# EAGLE design lupa300-card (EAGLE 8.6.1)

## Sheet 1 of 4: LUPA300
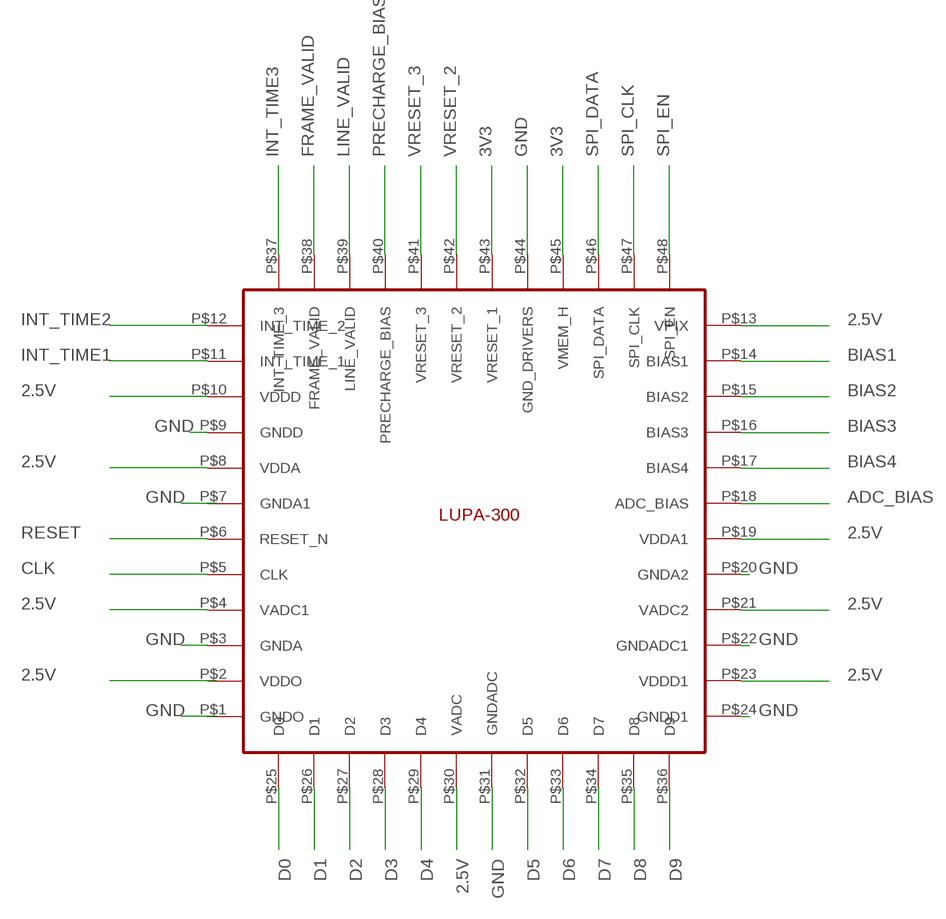
[diagram p0: schematic, sheet 1]

### Parts
U$1  LUPA300  [LUPA300]

### Nets
2.5V: U$1.P$2(VDDO) U$1.P$4(VADC1) U$1.P$8(VDDA) U$1.P$10(VDDD) U$1.P$13(VPIX) U$1.P$19(VDDA1) U$1.P$21(VADC2) U$1.P$23(VDDD1) U$1.P$30(VADC) ; also sheet 2,3
3V3: U$1.P$43(VRESET_1) U$1.P$45(VMEM_H) ; also sheet 3
ADC_BIAS: U$1.P$18(ADC_BIAS) ; also sheet 2
BIAS1: U$1.P$14(BIAS1) ; also sheet 2
BIAS2: U$1.P$15(BIAS2) ; also sheet 2
BIAS3: U$1.P$16(BIAS3) ; also sheet 2
BIAS4: U$1.P$17(BIAS4) ; also sheet 2
CLK: U$1.P$5(CLK) ; also sheet 4
D0: U$1.P$25(D0) ; also sheet 4
D1: U$1.P$26(D1) ; also sheet 4
D2: U$1.P$27(D2) ; also sheet 4
D3: U$1.P$28(D3) ; also sheet 4
D4: U$1.P$29(D4) ; also sheet 4
D5: U$1.P$32(D5) ; also sheet 4
D6: U$1.P$33(D6) ; also sheet 4
D7: U$1.P$34(D7) ; also sheet 4
D8: U$1.P$35(D8) ; also sheet 4
D9: U$1.P$36(D9) ; also sheet 4
FRAME_VALID: U$1.P$38(FRAME_VALID) ; also sheet 4
GND: U$1.P$1(GNDO) U$1.P$3(GNDA) U$1.P$9(GNDD) U$1.P$20(GNDA2) U$1.P$22(GNDADC1) U$1.P$24(GNDD1) U$1.P$31(GNDADC) U$1.P$44(GND_DRIVERS) ; also sheet 2,3,4
INT_TIME1: U$1.P$11(INT_TIME_1) ; also sheet 4
INT_TIME2: U$1.P$12(INT_TIME_2) ; also sheet 4
INT_TIME3: U$1.P$37(INT_TIME_3) ; also sheet 4
LINE_VALID: U$1.P$39(LINE_VALID) ; also sheet 4
PRECHARGE_BIAS: U$1.P$40(PRECHARGE_BIAS) ; also sheet 2
RESET: U$1.P$6(RESET_N) ; also sheet 4
SPI_CLK: U$1.P$47(SPI_CLK) ; also sheet 4
SPI_DATA: U$1.P$46(SPI_DATA) ; also sheet 4
SPI_EN: U$1.P$48(SPI_EN) ; also sheet 4
VRESET_2: U$1.P$42(VRESET_2)
VRESET_3: U$1.P$41(VRESET_3)
Unconnected: U$1.P$7(GNDA1)

## Sheet 2 of 4: Biasing
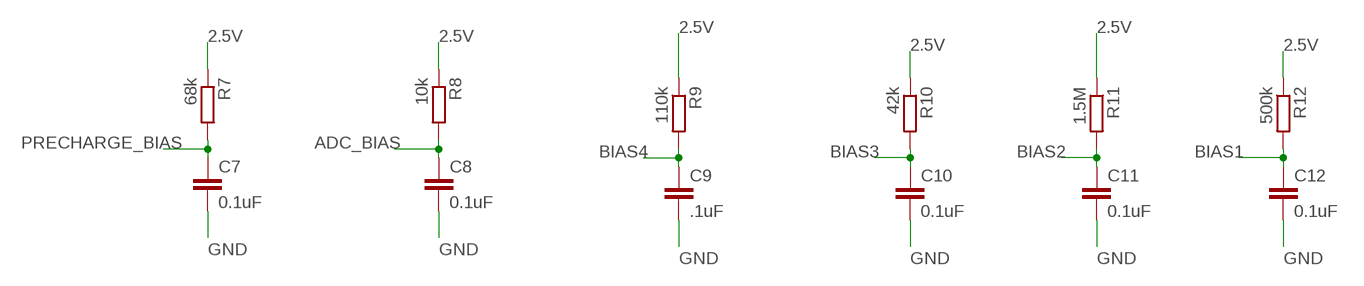
[diagram p1: schematic, sheet 2]

### Parts
C7  0.1uF  C-EUC0603K  [C0603K]
C8  0.1uF  C-EUC0603K  [C0603K]
C9  .1uF  C-EUC0603K  [C0603K]
C10  0.1uF  C-EUC0603K  [C0603K]
C11  0.1uF  C-EUC0603K  [C0603K]
C12  0.1uF  C-EUC0603K  [C0603K]
R7  68k  R-EU_R0603  [R0603]
R8  10k  R-EU_R0603  [R0603]
R9  110k  R-EU_R0603  [R0603]
R10  42k  R-EU_R0603  [R0603]
R11  1.5M  R-EU_R0603  [R0603]
R12  500k  R-EU_R0603  [R0603]

### Nets
2.5V: R7.1 R8.1 R9.1 R10.1 R11.1 R12.1 ; also sheet 1,3
ADC_BIAS: C8.1 R8.2 ; also sheet 1
BIAS1: C12.1 R12.2 ; also sheet 1
BIAS2: C11.1 R11.2 ; also sheet 1
BIAS3: C10.1 R10.2 ; also sheet 1
BIAS4: C9.1 R9.2 ; also sheet 1
GND: C7.2 C8.2 C9.2 C10.2 C11.2 C12.2 ; also sheet 1,3,4
PRECHARGE_BIAS: C7.1 R7.2 ; also sheet 1

## Sheet 3 of 4: Power
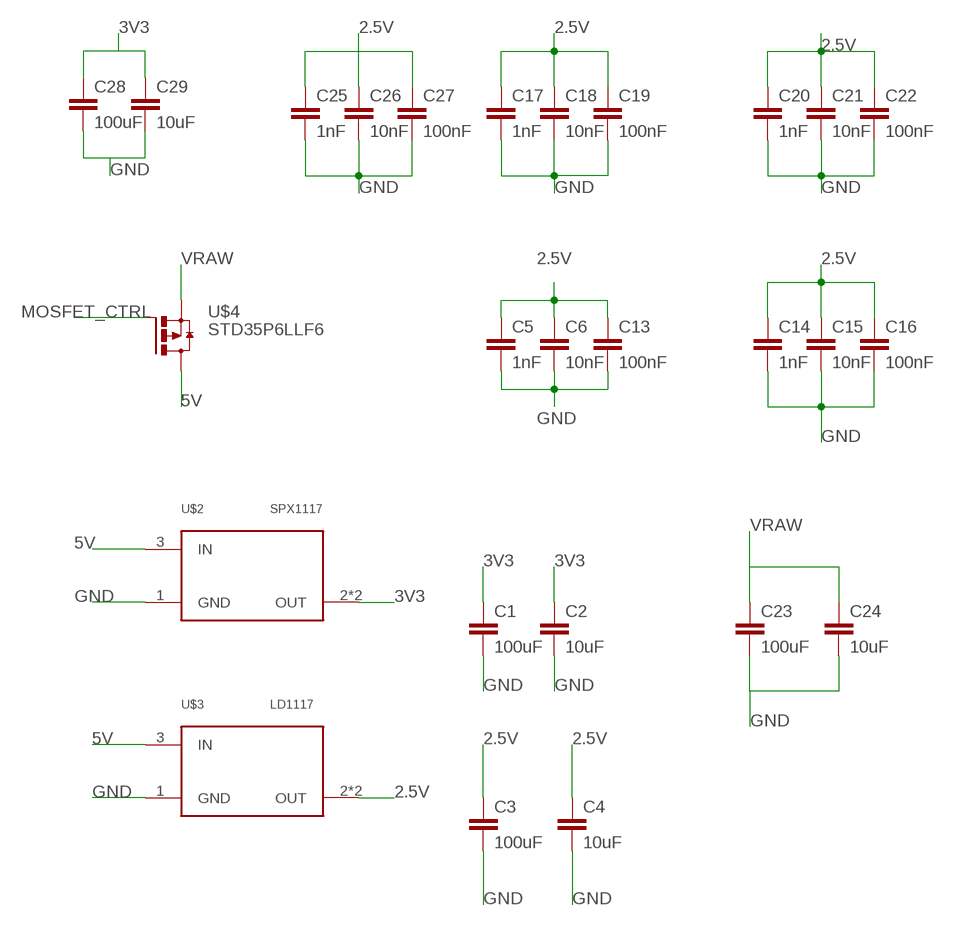
[diagram p2: schematic, sheet 3]

### Parts
C1  100uF  C-EUC1206K  [C1206K]
C2  10uF  C-EUC1206K  [C1206K]
C3  100uF  C-EUC1206K  [C1206K]
C4  10uF  C-EUC1206K  [C1206K]
C5  1nF  C-EUC0603  [C0603]
C6  10nF  C-EUC0603  [C0603]
C13  100nF  C-EUC0603  [C0603]
C14  1nF  C-EUC0603  [C0603]
C15  10nF  C-EUC0603  [C0603]
C16  100nF  C-EUC0603  [C0603]
C17  1nF  C-EUC0603  [C0603]
C18  10nF  C-EUC0603  [C0603]
C19  100nF  C-EUC0603  [C0603]
C20  1nF  C-EUC0603  [C0603]
C21  10nF  C-EUC0603  [C0603]
C22  100nF  C-EUC0603  [C0603]
C23  100uF  C-EUC1206  [C1206]
C24  10uF  C-EUC1206  [C1206]
C25  1nF  C-EUC0603  [C0603]
C26  10nF  C-EUC0603  [C0603]
C27  100nF  C-EUC0603  [C0603]
C28  100uF  C-EUC0603  [C0603]
C29  10uF  C-EUC0603  [C0603]
U$2  SPX1117  [SOT223]
U$3  LD1117  [SOT223]
U$4  STD35P6LLF6  [DPACK]

### Nets
2.5V: C3.1 C4.1 C5.1 C6.1 C13.1 C14.1 C15.1 C16.1 C17.1 C18.1 C19.1 C20.1 C21.1 C22.1 C25.1 C26.1 C27.1 U$3.2(OUT) U$3.4(OUT) ; also sheet 1,2
3V3: C1.1 C2.1 C28.1 C29.1 U$2.2(OUT) U$2.4(OUT) ; also sheet 1
5V: U$2.3(IN) U$3.3(IN) U$4.2(D)
GND: C1.2 C2.2 C3.2 C4.2 C5.2 C6.2 C13.2 C14.2 C15.2 C16.2 C17.2 C18.2 C19.2 C20.2 C21.2 C22.2 C23.2 C24.2 C25.2 C26.2 C27.2 C28.2 C29.2 U$2.1(GND) U$3.1(GND) ; also sheet 1,2,4
MOSFET_CTRL: U$4.1(G) ; also sheet 4
VRAW: C23.1 C24.1 U$4.3(S) ; also sheet 4

## Sheet 4 of 4: Headers
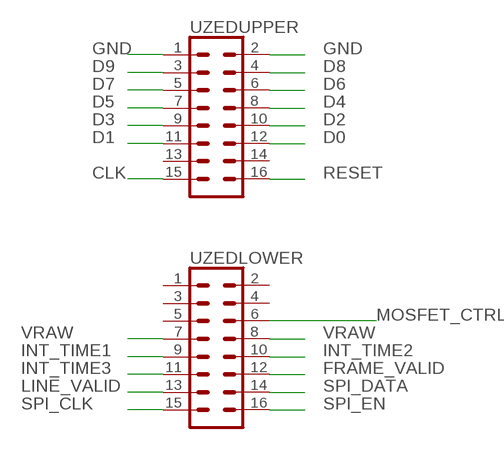
[diagram p3: schematic, sheet 4]

### Parts
UZEDLOWER  CONN_08X2  [2X8]
UZEDUPPER  CONN_08X2  [2X8]

### Nets
CLK: UZEDUPPER.15 ; also sheet 1
D0: UZEDUPPER.12 ; also sheet 1
D1: UZEDUPPER.11 ; also sheet 1
D2: UZEDUPPER.10 ; also sheet 1
D3: UZEDUPPER.9 ; also sheet 1
D4: UZEDUPPER.8 ; also sheet 1
D5: UZEDUPPER.7 ; also sheet 1
D6: UZEDUPPER.6 ; also sheet 1
D7: UZEDUPPER.5 ; also sheet 1
D8: UZEDUPPER.4 ; also sheet 1
D9: UZEDUPPER.3 ; also sheet 1
FRAME_VALID: UZEDLOWER.12 ; also sheet 1
GND: UZEDUPPER.1 UZEDUPPER.2 ; also sheet 1,2,3
INT_TIME1: UZEDLOWER.9 ; also sheet 1
INT_TIME2: UZEDLOWER.10 ; also sheet 1
INT_TIME3: UZEDLOWER.11 ; also sheet 1
LINE_VALID: UZEDLOWER.13 ; also sheet 1
MOSFET_CTRL: UZEDLOWER.6 ; also sheet 3
RESET: UZEDUPPER.16 ; also sheet 1
SPI_CLK: UZEDLOWER.15 ; also sheet 1
SPI_DATA: UZEDLOWER.14 ; also sheet 1
SPI_EN: UZEDLOWER.16 ; also sheet 1
VRAW: UZEDLOWER.7 UZEDLOWER.8 ; also sheet 3
Unconnected: UZEDLOWER.1 UZEDLOWER.2 UZEDLOWER.3 UZEDLOWER.4 UZEDLOWER.5 UZEDUPPER.13 UZEDUPPER.14

## Library data of the parts
C1-C29 = rcl:C-EU: CAPACITOR, European symbol; SPICEPREFIX: C
R7-R12 = rcl:R-EU_: RESISTOR, European symbol; SPICEPREFIX: R
U$1 = andon:LUPA300
U$2 = lupa300-components:SPX1117: IC REG LINEAR 3.3V 800MA SOT223
U$3 = lupa300-components:LD1117: IC REG LINEAR 2.5V 800MA SOT223
U$4 = lupa300-components:STD35P6LLF6: MOSFET P-CH 60V 35A DPAK
UZEDLOWER UZEDUPPER = SparkFun-Connectors:CONN_08X2: Multi connection point. Often used as Generic Header-pin footprint for 0.1 inch spaced/style header connections You can populate with any combo of single row headers, but if you'd like an exact match, check this: Header - 2x8 (Male, 0.1") <https://www.sparkfun.com/products/13156> (PRT-13156) On any of the 0.1 inch spaced packages, you can populate with these: Break Away Headers - Straight <https://www.sparkfun.com/products/116> (PRT-00116) Break Away Male Headers - Right Angle <https://www.sparkfun.com/products/553> (PRT-00553) Female Headers <https://www.sparkfun.com/products/115> (PRT-00115) Break Away Headers - Machine Pin <https://www.sparkfun.com/products/117> (PRT-00117) Break Away Female Headers - Swiss Machine Pin <https://www.sparkfun.com/products/743> (PRT-00743)

## Board
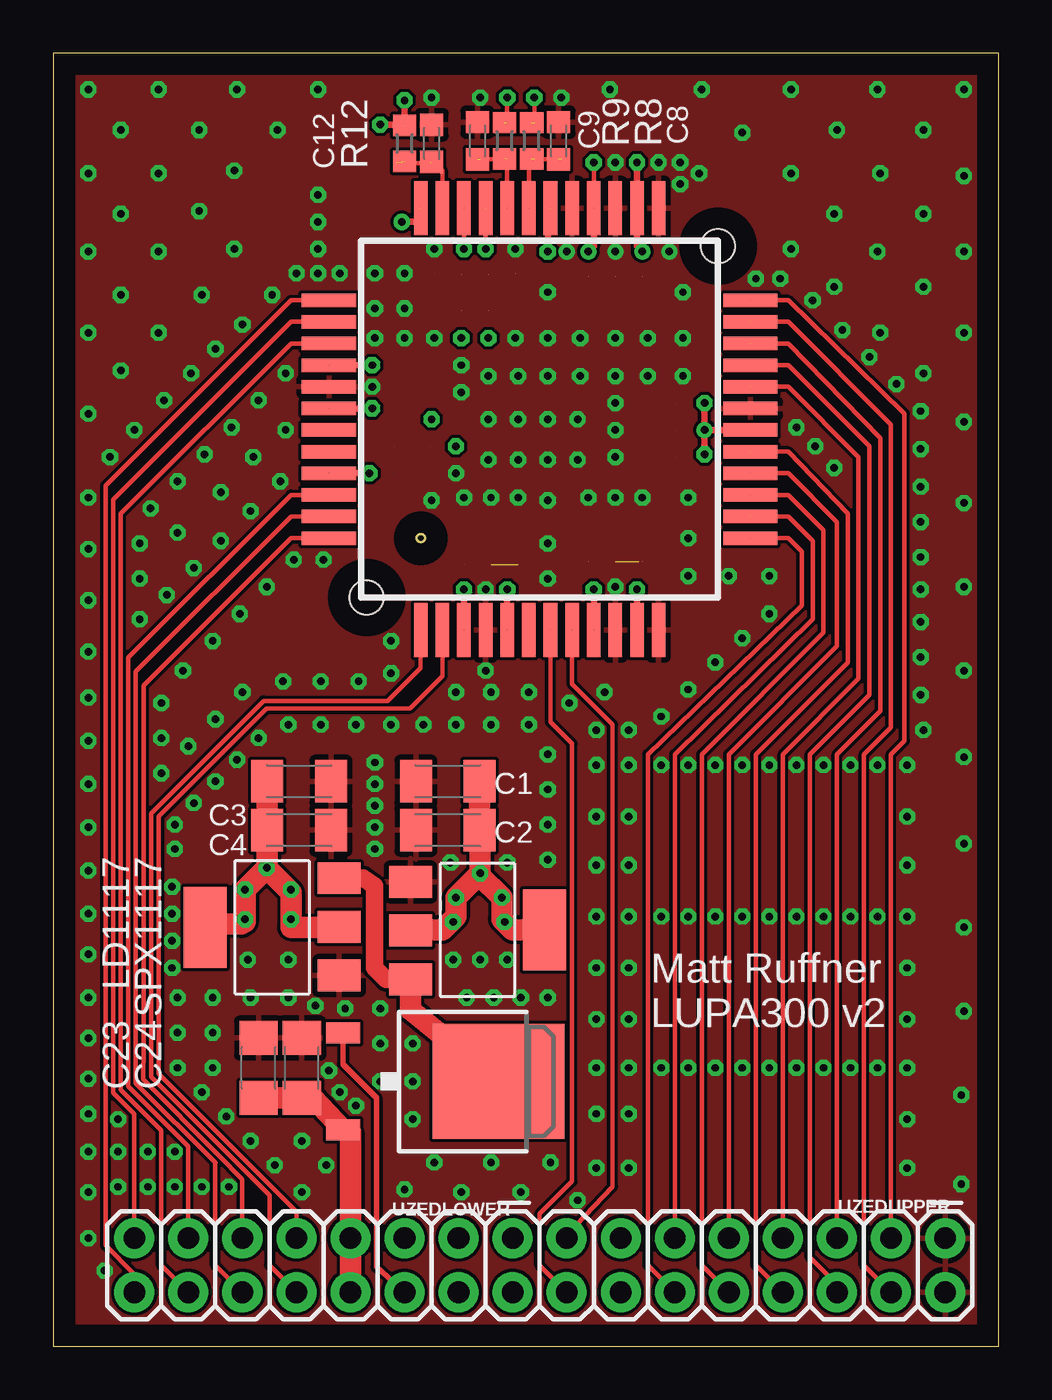
[diagram p4: board, top side]
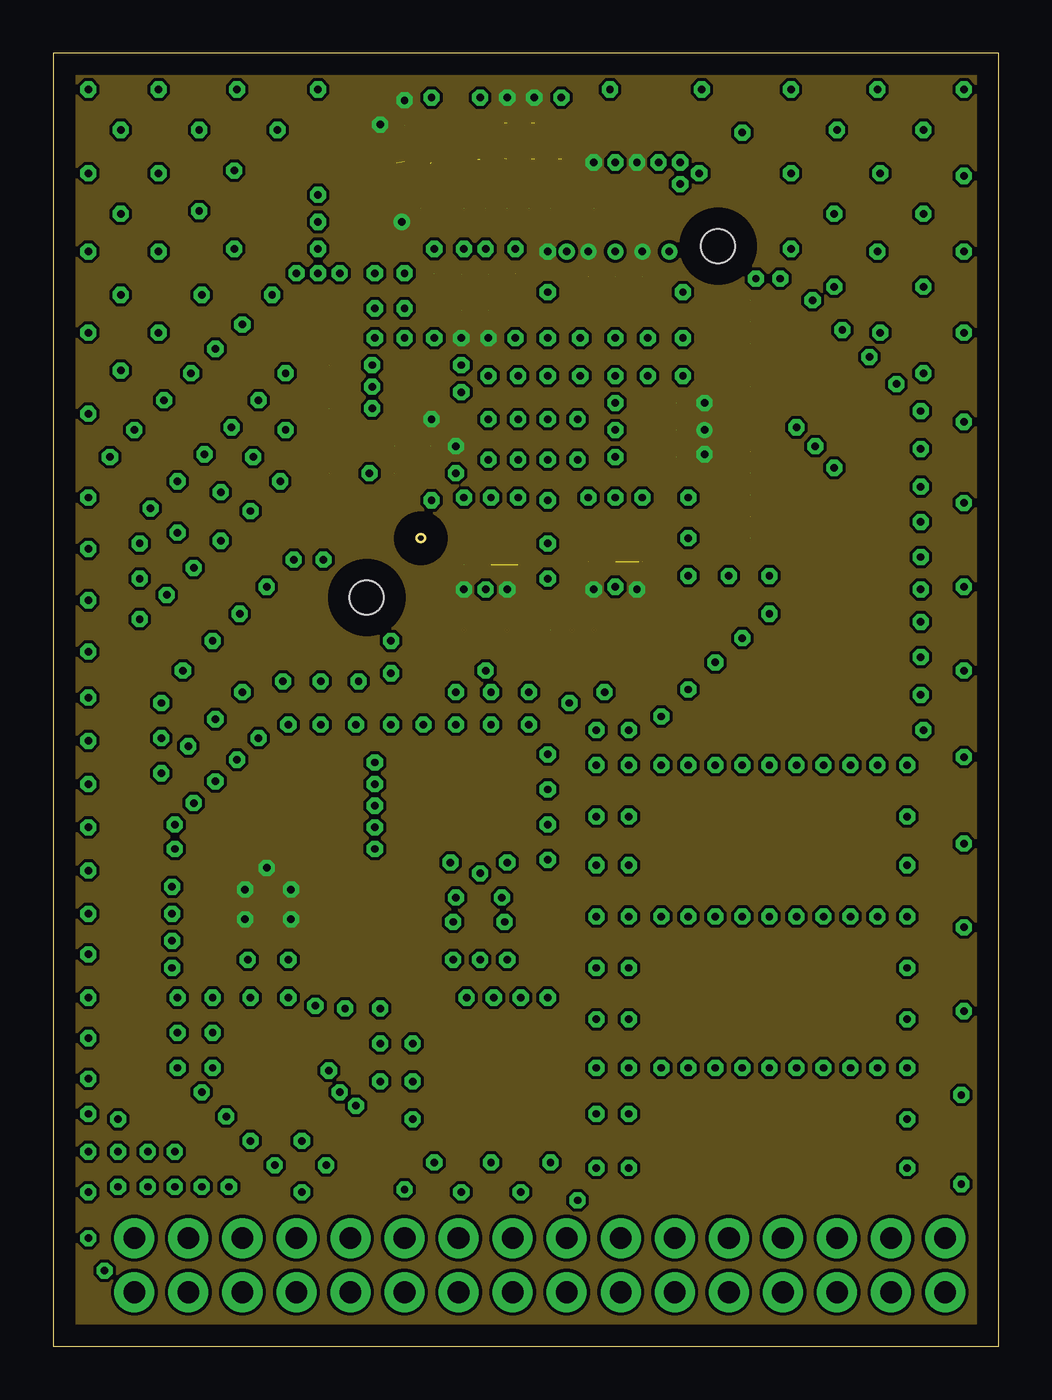
[diagram p5: board, inner layer Route2]
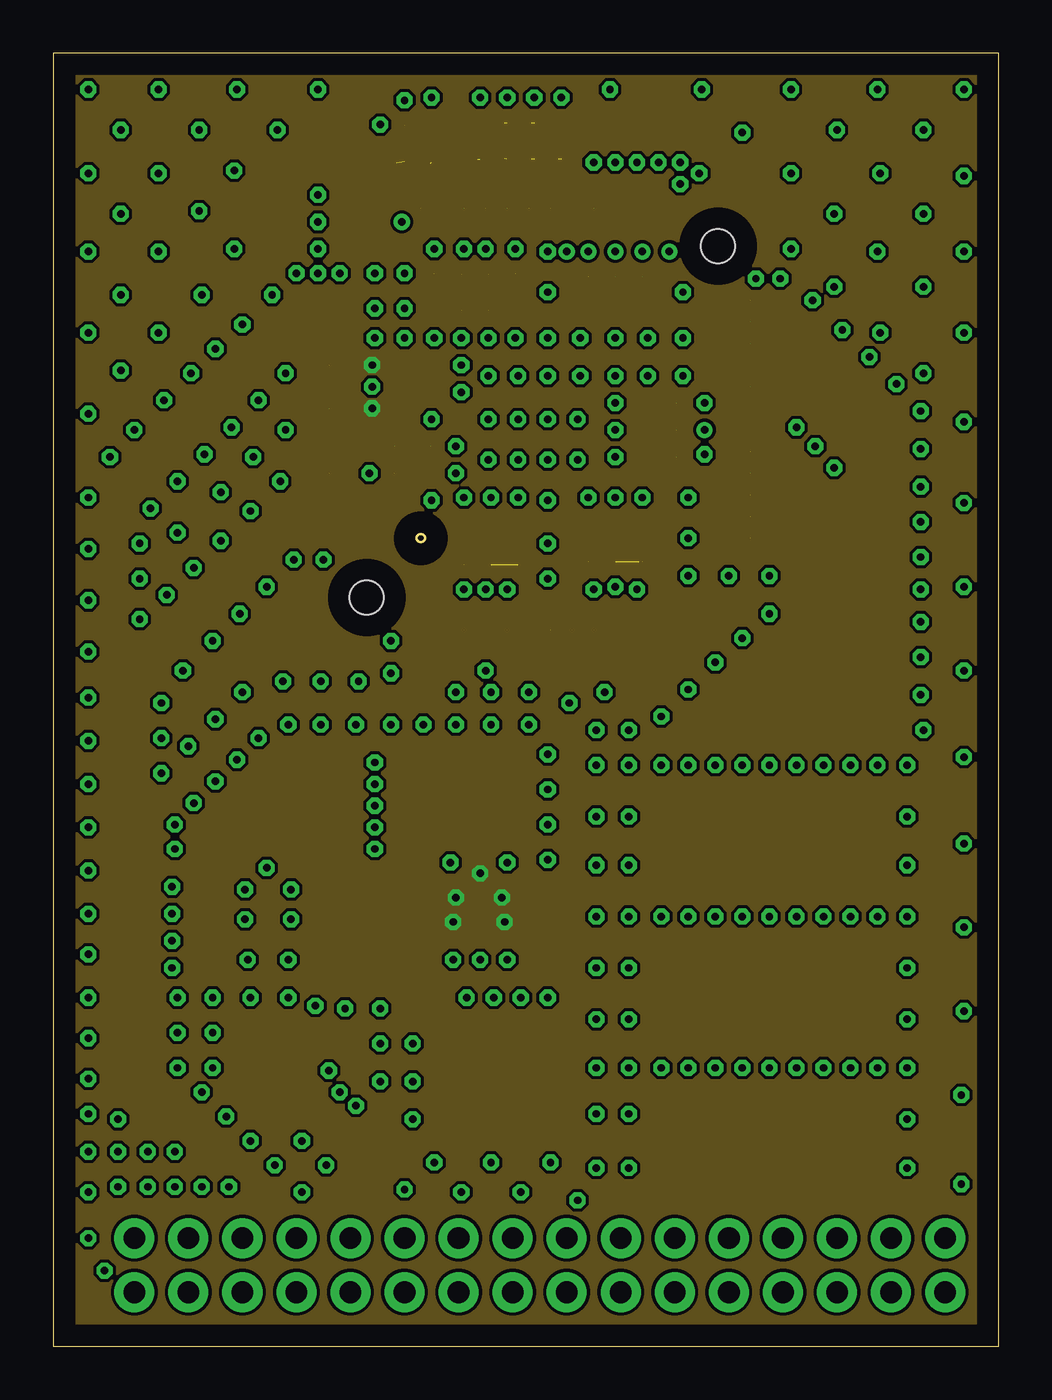
[diagram p6: board, inner layer Route15]
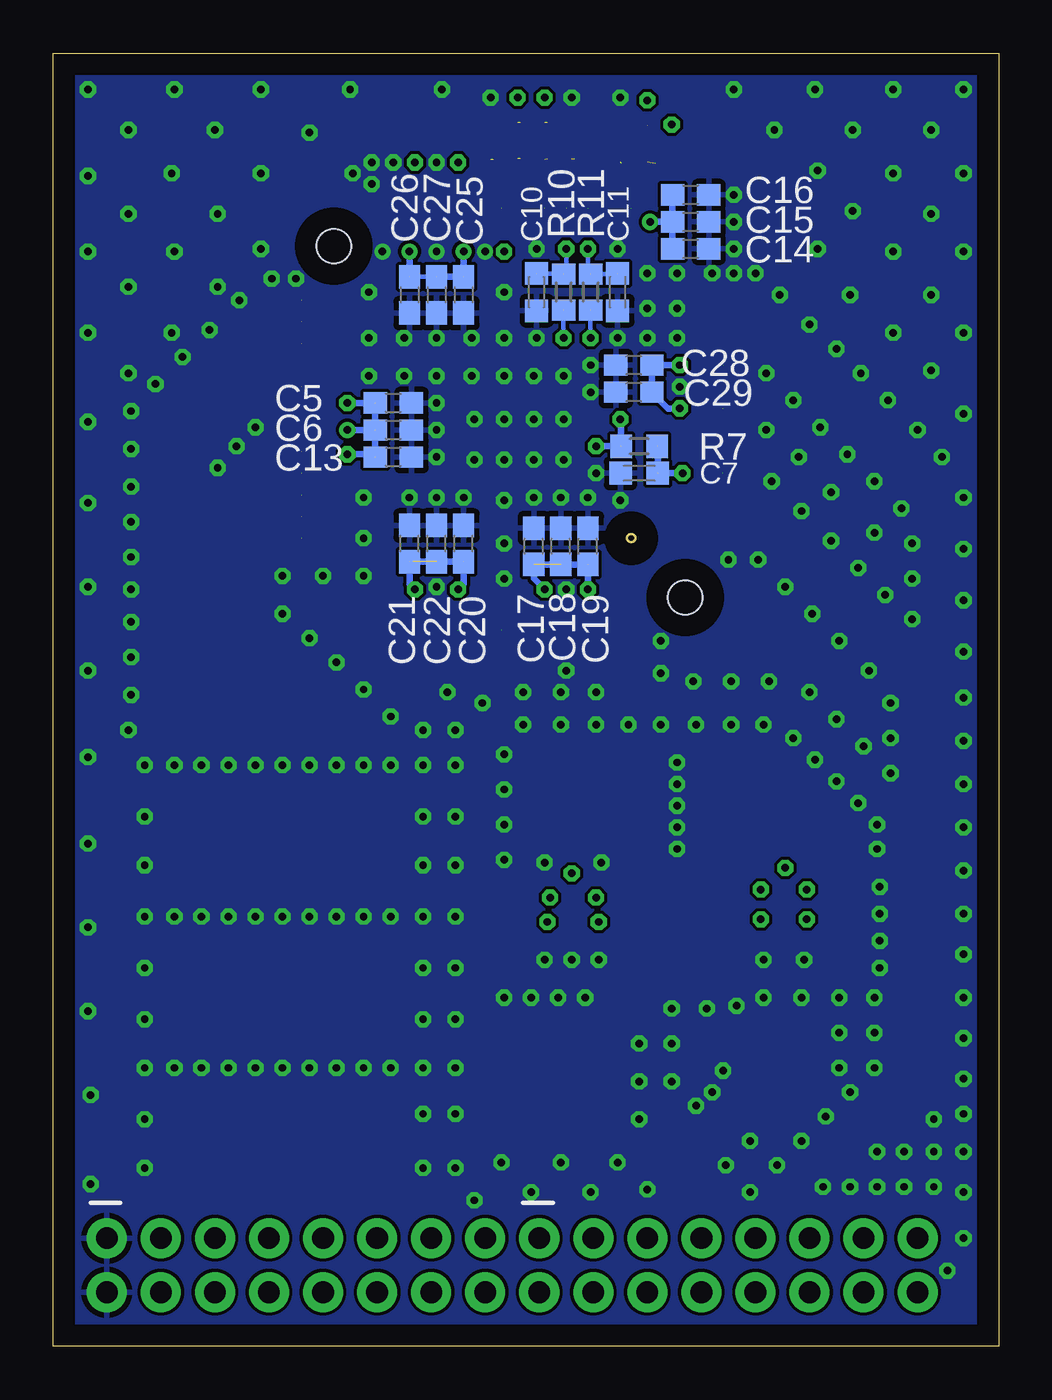
[diagram p7: board, bottom side, seen from below]

Size 44.43 x 60.76 mm. Coordinates in mm from the lower left corner, seen from the top.
Outline: 0,0 44.43,0 44.43,60.76 0,60.76 0,0
Copper layers (1+2*15+16): Top 0.035mm / dielectric 1.5mm / Route2 0.035mm / dielectric 0.15mm / Route15 0.035mm / dielectric 0.2mm / Bottom 0.035mm
Design rules "default *": minimum track width 6mil, minimum drill 0.35mm, track to track 6mil, track to pad 6mil, pad to pad 6mil, via to via 6mil, smd to smd 6mil, copper to edge 40mil, drill to drill 6mil, minimum pad ring 10mil, minimum via ring 8mil, stop-mask expansion 4mil, vias tented up to drill 0mil, thermal gap 10mil

### Footprints (pad centres in the part's own frame; a part is rotated, then mirrored left to right if it is on the bottom)
C1206K = smd 1.5 x 2: 1 -1.5,0; 2 1.5,0
C0603 = smd 1.1 x 1: 1 -0.85,0; 2 0.85,0
C0603K = smd 1.05 x 1.08: 1 -0.875,0; 2 0.875,0
C1206 = smd 1.6 x 1.8: 1 -1.4,0; 2 1.4,0
R0603 = smd 1 x 1.1: 1 -0.85,0; 2 0.85,0
LUPA300 = smd 2.54 x 0.635: P$1 -2.794,1.524; P$2 -2.794,2.54; P$3 -2.794,3.556; P$4 -2.794,4.572; P$5 -2.794,5.588; P$6 -2.794,6.604; P$7 -2.794,7.62; P$8 -2.794,8.636; P$9 -2.794,9.652; P$10 -2.794,10.668; P$11 -2.794,11.684; P$12 -2.794,12.7; P$13 17.018,12.7; P$14 17.018,11.684; P$15 17.018,10.668; P$16 17.018,9.652; P$17 17.018,8.636; P$18 17.018,7.62; P$19 17.018,6.604; P$20 17.018,5.588; P$21 17.018,4.572; P$22 17.018,3.556; P$23 17.018,2.54; P$24 17.018,1.524 | smd 0.635 x 2.54: P$25 1.524,-2.794; P$26 2.54,-2.794; P$27 3.556,-2.794; P$28 4.572,-2.794; P$29 5.588,-2.794; P$30 6.604,-2.794; P$31 7.62,-2.794; P$32 8.636,-2.794; P$33 9.652,-2.794; P$34 10.668,-2.794; P$35 11.684,-2.794; P$36 12.7,-2.794; P$37 1.524,17.018; P$38 2.54,17.018; P$39 3.556,17.018; P$40 4.572,17.018; P$41 5.588,17.018; P$42 6.604,17.018; P$43 7.62,17.018; P$44 8.636,17.018; P$45 9.652,17.018; P$46 10.668,17.018; P$47 11.684,17.018; P$48 12.7,17.018 | hole 1.6: -1.27,15.24; 15.24,-1.27
SOT223 = smd 1.499 x 2.007: 1 -2.261,-3.15; 2 0.025,-3.15; 3 2.311,-3.15 | smd 3.81 x 2.007: 4 0,3.15
DPACK = smd 1 x 1.6: 1 -2.28,-4.8; 3 2.28,-4.8 | smd 5.4 x 6.2: 2 0,2.5
2X8 = drill 1.016 pad 1.88: 1 0,0; 2 0,2.54; 3 2.54,0; 4 2.54,2.54; 5 5.08,0; 6 5.08,2.54; 7 7.62,0; 8 7.62,2.54; 9 10.16,0; 10 10.16,2.54; 11 12.7,0; 12 12.7,2.54; 13 15.24,0; 14 15.24,2.54; 15 17.78,0; 16 17.78,2.54

### Placement (x,y rotation side)
C1  18.54,26.54 180 top
C2  18.54,24.26 180 top
C3  11.56,26.54 0 top
C4  11.56,24.26 0 top
C5  28.45,44.32 0 bottom
C6  28.45,43.05 0 bottom
C7  16.89,41.02 180 bottom
C8  23.75,56.64 90 top
C9  19.94,56.64 90 top
C10  21.72,49.53 270 bottom
C11  17.91,49.53 270 bottom
C12  17.78,56.52 90 top
C13  28.45,41.78 0 bottom
C14  14.48,51.56 0 bottom
C15  14.48,52.83 0 bottom
C16  14.48,54.1 0 bottom
C17  21.84,37.59 90 bottom
C18  20.57,37.59 90 bottom
C19  19.3,37.59 90 bottom
C20  25.15,37.72 90 bottom
C21  27.69,37.72 90 bottom
C22  26.42,37.72 90 bottom
C23  9.65,13.08 90 top
C24  11.68,13.08 90 top
C25  25.15,49.4 270 bottom
C26  27.69,49.4 270 bottom
C27  26.42,49.4 270 bottom
C28  17.14,46.1 180 bottom
C29  17.14,44.83 180 bottom
R7  16.89,42.29 0 bottom
R8  22.48,56.64 270 top
R9  21.21,56.64 270 top
R10  20.45,49.53 90 bottom
R11  19.18,49.53 90 bottom
R12  16.51,56.52 270 top
U$1  29.97,36.45 90 top
U$2  19.94,19.56 270 top
U$3  10.29,19.68 90 top
U$4  18.41,12.45 270 top
UZEDLOWER  21.59,5.08 180 top
UZEDUPPER  41.91,5.08 180 top

### Tracks (layer width: path | path; a pad name or v marks a point on that pad's centre or on a via)
2.5V  (via drill 0.35)  (24 unrouted)
  Top 0.203: 22.61,57.49 | 22.61,57.49 v22.61,58.67 | 21.34,57.49 v21.34,58.67 | v21.34,58.67 | v25.4,55.63 U$1.P$21
  Top 0.305: U$1.P$30 | v16.38,52.83 17.27,52.83 | 17.27,52.83 | 17.27,52.83 U$1.P$13 | U$1.P$21 25.4,51.69 v25.15,51.44 | U$1.P$23 27.43,51.69 v27.69,51.44 | v23.24,51.44 23.24,53.34 U$1.P$19 | v16.51,58.55 R12.1 | R12.1 | v15.37,57.4 16.47,57.4 R12.1 | v30.61,43.05 U$1.P$30 | v27.43,35.56 U$1.P$2 | U$1.P$2 | v25.4,35.56 U$1.P$4 | v19.3,35.56 U$1.P$10 | v21.34,35.56 U$1.P$8 | v30.61,41.91 v30.61,43.05 | v30.61,43.05 v30.61,44.32 | v27.43,55.63 U$1.P$23 | U$1.P$23
  Top 1.016: C3.1 C4.1 10.06,22.5 v10.03,22.48 | U$3.4 7.16,19.84 8.87,19.84 9.02,19.94 v9.02,21.46 v10.03,22.48 | v10.03,22.48 11.18,21.34 11.18,19.68 13.28,19.68 U$3.2
  Bottom 0.203: C26.1 C27.1 | R10.1 | R10.1 v20.45,47.37 | R11.1 v19.18,47.37
  Bottom 0.305: C16.1 C15.1 | C15.1 C14.1 | C15.1 v16.38,52.83 | v25.15,51.44 C25.1 C27.1 | C26.1 v27.69,51.44 | C6.1 | C6.1 v30.61,43.05 | C5.1 | C5.1 C6.1 | C6.1 C13.1 29.43,41.91 v30.61,41.91 | v25.4,35.56 25.15,35.81 C20.1 27.52,36.87 27.69,36.7 | C21.1 27.69,36.7 | 27.69,36.7 27.69,35.81 v27.43,35.56 | C19.1 C17.1 21.84,36.07 v21.34,35.56 | v19.3,35.56 C19.1 | C19.1 | v30.61,44.32 | v30.61,44.32 C5.1 | v17.78,43.56 17.74,43.52 R7.1 v18.92,42.29 | v18.92,42.29
  other vias: 11.18,21.46 9.02,20.07 11.18,20.07
  pour Route2: 0.64,-1.27 45.72,-1.27 45.72,64.77 0.64,64.77
3V3  (via drill 0.35)  (2 unrouted)
  Top 0.305: U$1.P$45 v14.99,46.1 | v14.99,46.1 | U$1.P$43 v14.99,44.07 | v14.99,44.07
  Top 1.016: C1.1 C2.1 20.07,24.23 v20.07,22.22 | v20.07,22.22 v18.92,21.08 18.92,20.19 18.29,19.56 16.82,19.56 U$2.2 | v20.07,22.22 20.07,22.1 v21.08,21.08 21.08,20.07 21.59,19.56 U$2.4
  Bottom 0.305: v14.99,46.1 C28.1 C29.1 15.53,44.07 v14.99,44.07
  other vias: 18.8,19.94 21.21,19.94
  pour Route15: 0.64,-1.27 45.72,-1.27 45.72,64.77 0.64,64.77
5V
  Top 0.813: U$2.3 16.04,17.23 15.64,17.23 15.1,17.77 15.1,20.61 15.09,21.63 14.57,22.01 U$3.3
  Top 1.016: U$4.2 16.79,15.81 U$2.3
ADC_BIAS  (3 unrouted)
  Top 0.203: 23.88,55.77 22.63,55.77 22.61,55.79 22.61,55.63 22.35,55.37 U$1.P$18
BIAS1  (2 unrouted)
  Top 0.203: 16.13,55.59 17.73,55.59 17.78,55.77 17.78,55.75 18.29,55.25 U$1.P$14 | U$1.P$14
BIAS2  (via drill 0.35)  (3 unrouted)
  Top 0.203: U$1.P$15 v19.3,51.56 | v19.3,51.56
  Bottom 0.203: v19.3,51.56 19.3,50.51 R11.2 17.93,50.38 C11.1
BIAS3  (via drill 0.35)  (3 unrouted)
  Top 0.203: U$1.P$16 v20.32,51.56 | v20.32,51.56
  Bottom 0.203: v20.32,51.56 20.32,50.51 R10.2 20.47,50.41 C10.1
BIAS4  (3 unrouted)
  Top 0.203: 20.07,55.77 21.31,55.77 21.34,55.79 U$1.P$17 | U$1.P$17
CLK  (1 unrouted)
  Top 0.203: UZEDUPPER.15 24.13,5.21 26.29,7.49 26.29,29.21 24.38,31.11 U$1.P$5
D0  (1 unrouted)
  Top 0.203: 34.54,37.97 35.18,37.34 35.18,34.8 27.94,27.81 27.94,3.81 UZEDUPPER.12 | 34.54,37.97 | 34.54,37.97 U$1.P$25
D1  (1 unrouted)
  Top 0.203: UZEDUPPER.11 29.21,27.81 35.69,34.16 35.69,37.85 34.54,38.99 34.42,38.99 U$1.P$26
D2  (1 unrouted)
  Top 0.203: UZEDUPPER.10 30.48,3.81 30.48,27.81 36.2,33.53 36.2,38.35 34.54,40.01 | 34.54,40.01 | 34.54,40.01 U$1.P$27
D3  (1 unrouted)
  Top 0.203: UZEDUPPER.9 31.75,27.81 36.83,32.89 36.83,38.73 34.54,41.02 U$1.P$28
D4  (1 unrouted)
  Top 0.203: UZEDUPPER.8 33.02,3.81 33.02,27.81 37.34,32.13 37.34,39.12 34.54,42.04 | 34.54,42.04 | 34.54,42.04 U$1.P$29
D5  (1 unrouted)
  Top 0.203: UZEDUPPER.7 34.29,27.81 37.85,31.37 37.85,41.78 34.54,45.09 U$1.P$32
D6
  Top 0.203: UZEDUPPER.6 36.83,2.92 35.56,4.19 35.56,27.81 38.35,30.61 38.35,42.29 34.54,46.1 U$1.P$33 | U$1.P$33
D7  (1 unrouted)
  Top 0.203: UZEDUPPER.5 36.83,27.81 38.86,29.84 38.86,42.67 34.54,47.12 U$1.P$34 | U$1.P$34
D8  (1 unrouted)
  Top 0.203: UZEDUPPER.4 38.1,3.81 38.1,27.81 39.37,29.08 39.37,43.31 34.54,48.13 | 34.54,48.13 | 34.54,48.13 U$1.P$35
D9  (1 unrouted)
  Top 0.203: UZEDUPPER.3 39.37,27.81 40.01,28.45 40.01,43.82 34.54,49.15 | 34.54,49.15 | 34.54,49.15 U$1.P$36
FRAME_VALID
  Top 0.203: UZEDLOWER.12 7.62,3.81 7.62,8.61 7.62,8.62 3.89,12.36 3.89,31.7 11.18,38.99 U$1.P$38
GND  (via drill 0.35)
  other vias: 26.42,51.44 24.13,51.44 28.96,51.44 17.91,51.56 21.72,51.56 21.72,47.37 17.91,47.37 20.07,58.67 23.88,58.67 17.78,58.67 26.42,35.69 20.32,35.56 19.3,39.88 20.57,39.88 21.84,39.88 25.15,39.88 26.42,39.88 27.69,39.88 26.42,44.32 26.42,43.05 26.42,41.78 12.45,51.56 12.45,52.83 12.45,54.1 26.42,55.63 28.45,55.63 29.46,55.63 29.46,54.61 17.78,39.75 18.92,41.02 34.92,43.18 35.81,42.29 36.7,41.27 27.05,24.89 28.57,27.3 29.84,27.3 31.11,27.3 32.38,27.3 33.66,27.3 34.92,27.3 36.2,27.3 37.47,27.3 38.73,27.3 40.13,24.89 27.05,22.61 40.13,22.61 27.05,20.19 28.57,20.19 29.84,20.19 31.11,20.19 32.38,20.19 34.92,20.19 36.2,20.19 33.66,20.19 37.47,20.19 38.73,20.19 40.13,20.19 27.05,27.3 27.05,17.78 27.05,15.37 27.05,13.08 27.05,10.92 27.05,8.38 25.53,27.3 25.53,24.89 25.53,22.61 25.53,20.19 25.53,17.78 25.53,15.37 25.53,13.08 25.53,10.92 25.53,8.38 40.13,27.3 28.57,29.59 29.84,30.86 31.11,32.13 32.38,33.27 33.66,34.42 33.66,36.2 31.75,36.2 29.84,36.2 29.84,37.97 29.84,39.88 40.13,17.78 40.13,15.37 40.13,13.08 38.73,13.08 37.47,13.08 36.2,13.08 34.92,13.08 33.66,13.08 32.38,13.08 31.11,13.08 29.84,13.08 28.57,13.08 25.53,28.96 27.05,28.96 24.26,30.23 25.91,30.73 20.32,31.75 40.13,10.67 40.13,8.38 40.89,28.96 40.77,30.61 40.77,32.39 40.77,34.04 40.77,35.56 40.77,37.08 40.77,38.73 40.77,40.39 40.77,42.16 40.77,43.94 39.62,45.21 38.35,46.48 37.08,47.75 35.69,49.15 23.24,16.38 15.11,23.37 15.11,24.38 15.11,25.4 15.11,26.42 15.11,27.43 21.97,16.38 20.7,16.38 19.43,16.38 18.67,22.73 21.34,22.73 18.8,18.16 20.07,18.16 21.34,18.16 14.99,45.09 19.18,46.1 19.18,44.83 5.59,21.59 5.59,20.32 5.59,19.05 5.59,17.78 3.05,10.67 3.05,9.14 3.05,7.49 4.45,9.14 4.45,7.49 5.71,9.14 5.71,7.49 6.99,7.49 8.26,7.49 11.68,7.24 10.41,8.51 9.27,9.65 8.13,10.79 6.99,11.94 5.84,13.08 5.84,14.73 5.84,16.38 2.41,3.56 1.65,5.08 1.65,7.24 1.65,9.14 1.65,10.92 1.65,12.57 1.65,14.48 1.65,16.38 1.65,18.41 1.65,20.32 1.65,22.35 1.65,24.38 1.65,26.42 1.65,28.45 1.65,30.48 1.65,32.64 1.65,35.05 1.65,37.47 1.65,39.88 2.67,41.78 3.81,43.05 5.21,44.45 6.48,45.72 7.62,46.86 8.89,48.01 10.29,49.4 11.43,50.42 12.45,50.42 13.46,50.42 4.06,34.16 5.33,35.31 6.6,36.58 7.87,37.85 9.27,39.24 10.67,40.64 6.1,31.75 7.49,33.15 8.76,34.42 10.03,35.69 11.3,36.96 5.71,23.37 5.71,24.51 6.6,25.53 7.62,26.54 8.64,27.56 9.65,28.57 11.05,29.21 12.57,29.21 14.22,29.21 15.88,29.21 17.4,29.21 18.92,30.73 20.57,30.73 22.35,30.73 22.35,29.21 23.24,27.81 23.24,26.16 23.24,24.51 23.24,22.86 5.08,30.23 5.08,28.57 5.08,26.92 6.35,28.19 7.62,29.46 8.89,30.73 10.79,31.24 12.57,31.24 14.35,31.24 15.88,31.62 15.88,33.15 12.7,36.96 24.64,6.86 4.06,36.07 4.06,37.72 4.57,39.37 5.84,40.64 7.11,41.91 8.38,43.18 9.65,44.45 10.92,45.72 10.92,43.05 5.84,38.23 7.87,40.13 9.4,41.78 34.16,50.16 33.02,50.16 21.84,41.66 21.84,43.56 21.84,45.59 20.45,41.66 20.45,43.56 20.45,45.59 23.24,45.59 23.24,43.56 23.24,41.66 23.24,39.75 23.24,37.72 23.24,36.07 23.24,47.37 23.24,49.53 24.77,45.59 26.42,45.59 24.64,43.56 24.64,41.66 24.77,47.37 26.42,47.37 27.94,47.37 27.94,45.59 29.59,47.37 29.59,45.59 29.59,49.53 16.51,47.37 16.51,48.77 16.51,50.42 15.11,50.42 15.11,48.77 15.11,47.37 1.65,43.82 1.65,47.62 1.65,51.44 1.65,55.12 1.65,59.05 3.17,45.85 3.17,49.4 3.17,53.21 3.17,57.15 4.95,59.05 4.95,55.12 4.95,51.44 4.95,47.62 8.64,59.05 6.86,57.15 8.51,55.25 8.51,51.56 6.86,53.34 6.99,49.4 10.54,57.15 12.45,59.05 18.92,29.21 20.57,29.21 42.8,59.05 42.8,54.99 42.8,51.44 42.8,47.62 38.73,59.05 34.67,59.05 30.48,59.05 26.16,59.05 38.86,55.12 34.67,55.12 30.35,55.12 32.38,57.02 36.83,57.15 40.89,57.15 38.73,51.44 36.7,53.21 40.89,53.21 40.89,49.78 36.7,49.78 34.67,51.56 38.86,47.62 40.89,45.72 42.8,43.43 42.8,39.62 42.8,35.69 42.8,31.75 42.8,27.69 42.8,23.62 42.8,19.68 42.8,15.75 42.67,11.81 42.67,7.62 23.37,8.64 21.97,7.24 20.57,8.64 19.18,7.24 17.91,8.64 16.51,7.37 7.49,14.73 7.49,16.38 7.49,13.08 9.27,16.38 11.05,16.38 9.14,18.16 11.05,18.16 15.37,15.88 13.72,15.88 12.32,16 15.37,14.22 16.89,14.22 16.89,12.45 16.89,10.67 15.37,12.45 12.95,12.95 13.46,11.94 14.22,11.3 11.68,9.65 12.83,8.51
  pour Top: 0.64,-1.27 45.72,-1.27 45.72,64.77 0.64,64.77
  pour Bottom: 0.64,-1.27 45.72,-1.27 45.72,64.77 0.64,64.77
INT_TIME1
  Top 0.203: UZEDLOWER.9 11.43,6.32 4.95,12.8 4.95,24.89 10.03,29.97 16.76,29.97 18.29,31.5 U$1.P$11
INT_TIME2
  Top 0.203: UZEDLOWER.10 10.16,3.81 10.16,7.09 4.6,12.65 4.6,25.04 9.89,30.33 15.72,30.33 17.27,31.88 U$1.P$12
INT_TIME3
  Top 0.203: UZEDLOWER.11 8.89,7.85 7.79,8.96 4.23,12.53 4.24,14.07 4.24,31.04 11.18,37.97 U$1.P$37
LINE_VALID
  Top 0.203: UZEDLOWER.13 6.35,9.39 3.53,12.21 3.53,32.36 11.18,40.01 U$1.P$39
MOSFET_CTRL
  Top 0.254: UZEDLOWER.6 15.19,3.73 15.19,11.68 13.62,13.26 U$4.1
PRECHARGE_BIAS  (via drill 0.35)  (3 unrouted)
  Top 0.305: U$1.P$40 v14.86,41.02 | v14.86,41.02
  Bottom 0.305: v14.86,41.02 C7.1 | C7.1 | C7.1 16.02,42.27 R7.2
RESET  (1 unrouted)
  Top 0.203: UZEDUPPER.16 22.86,3.81 22.86,6.22 24.38,7.75 24.38,28.32 23.37,29.34 U$1.P$6
SPI_CLK
  Top 0.203: UZEDLOWER.15 3.81,10.92 2.82,11.91 2.82,39.78 11.18,48.13 U$1.P$47
SPI_DATA
  Top 0.203: UZEDLOWER.14 5.08,3.81 5.08,10.15 3.17,12.06 3.17,39.12 11.18,47.12 U$1.P$46
SPI_EN
  Top 0.203: UZEDLOWER.16 3.81,3.39 2.46,4.74 2.46,40.44 11.18,49.15 U$1.P$48
VRAW
  Top 1.016: UZEDLOWER.8 UZEDLOWER.7 13.97,10.06 U$4.3 12.18,11.69 C24.1 C23.1

### Text on the board
tNames: Matt Ruffner / LUPA300 v2